# Altium schematic sheet p8_led_matrix.SchDoc
size A1; Organization: ORGANIZATION; Address1: ADDRESS 1; Address2: ADDRESS 2; Address3: ADDRESS 3; Address4: ADDRESS 4; Revision: Rev. A; SheetNumber: 8; SheetTotal: 8; ENG_APP_DATE: --/--/--; DSN_APP_DATE: --/--/--; CHK_APP_DATE: --/--/--
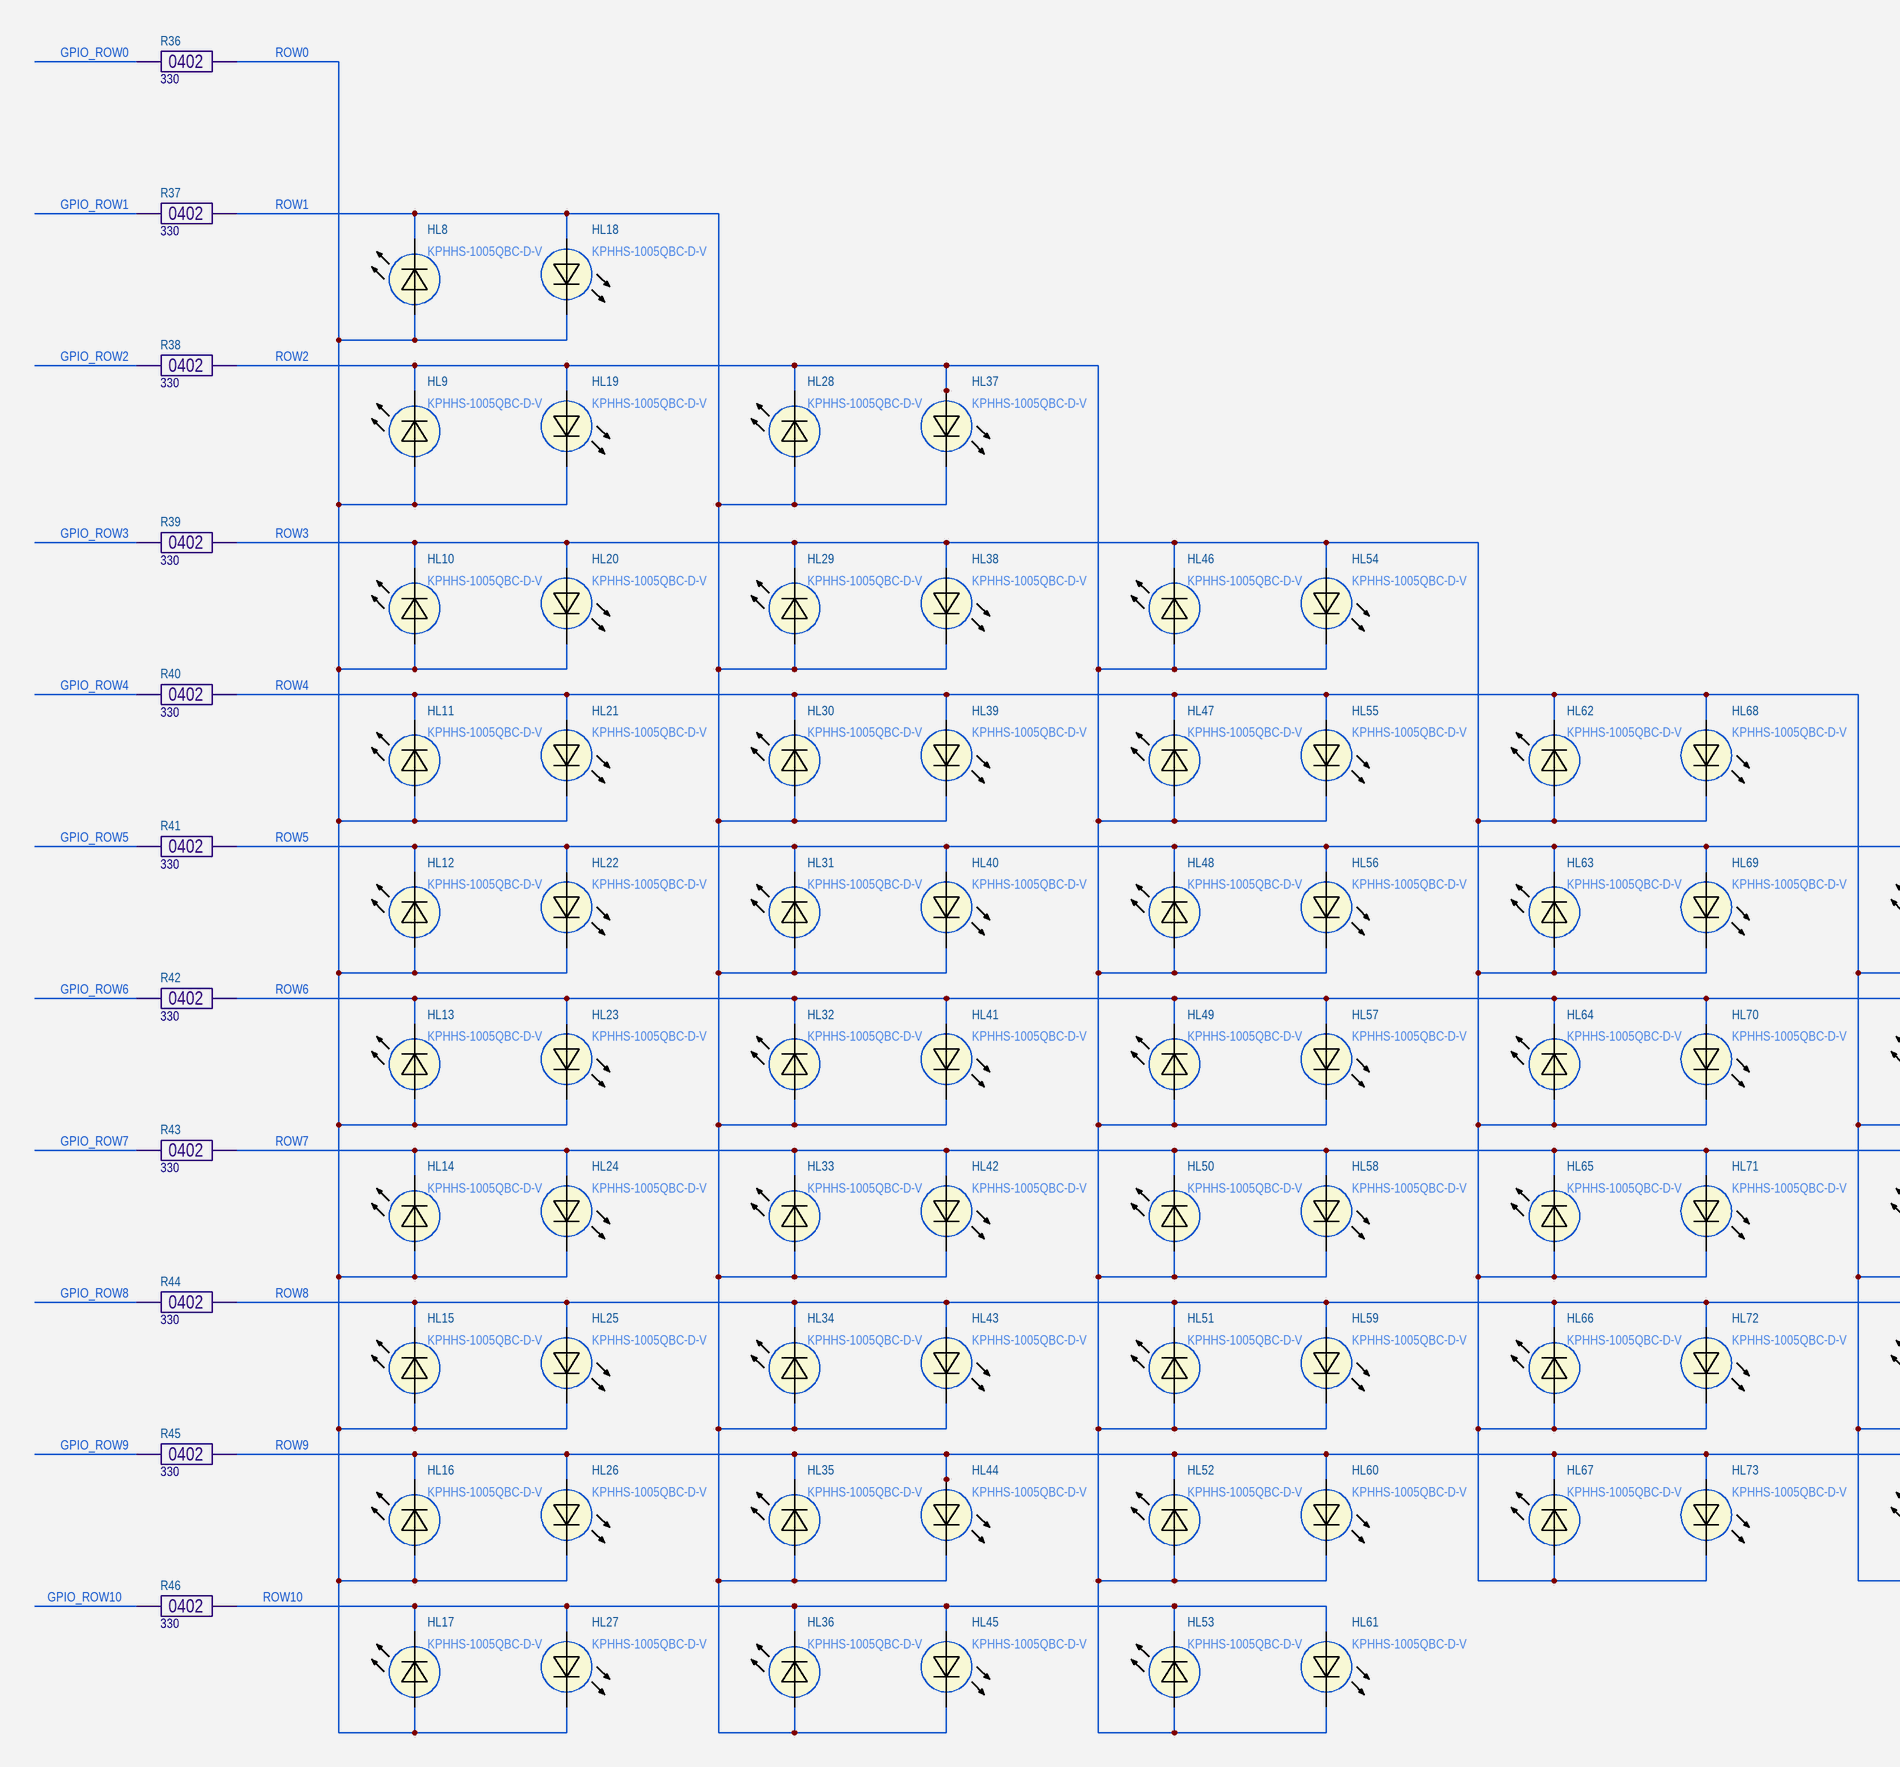
[diagram p0: p8_led_matrix.SchDoc, left]
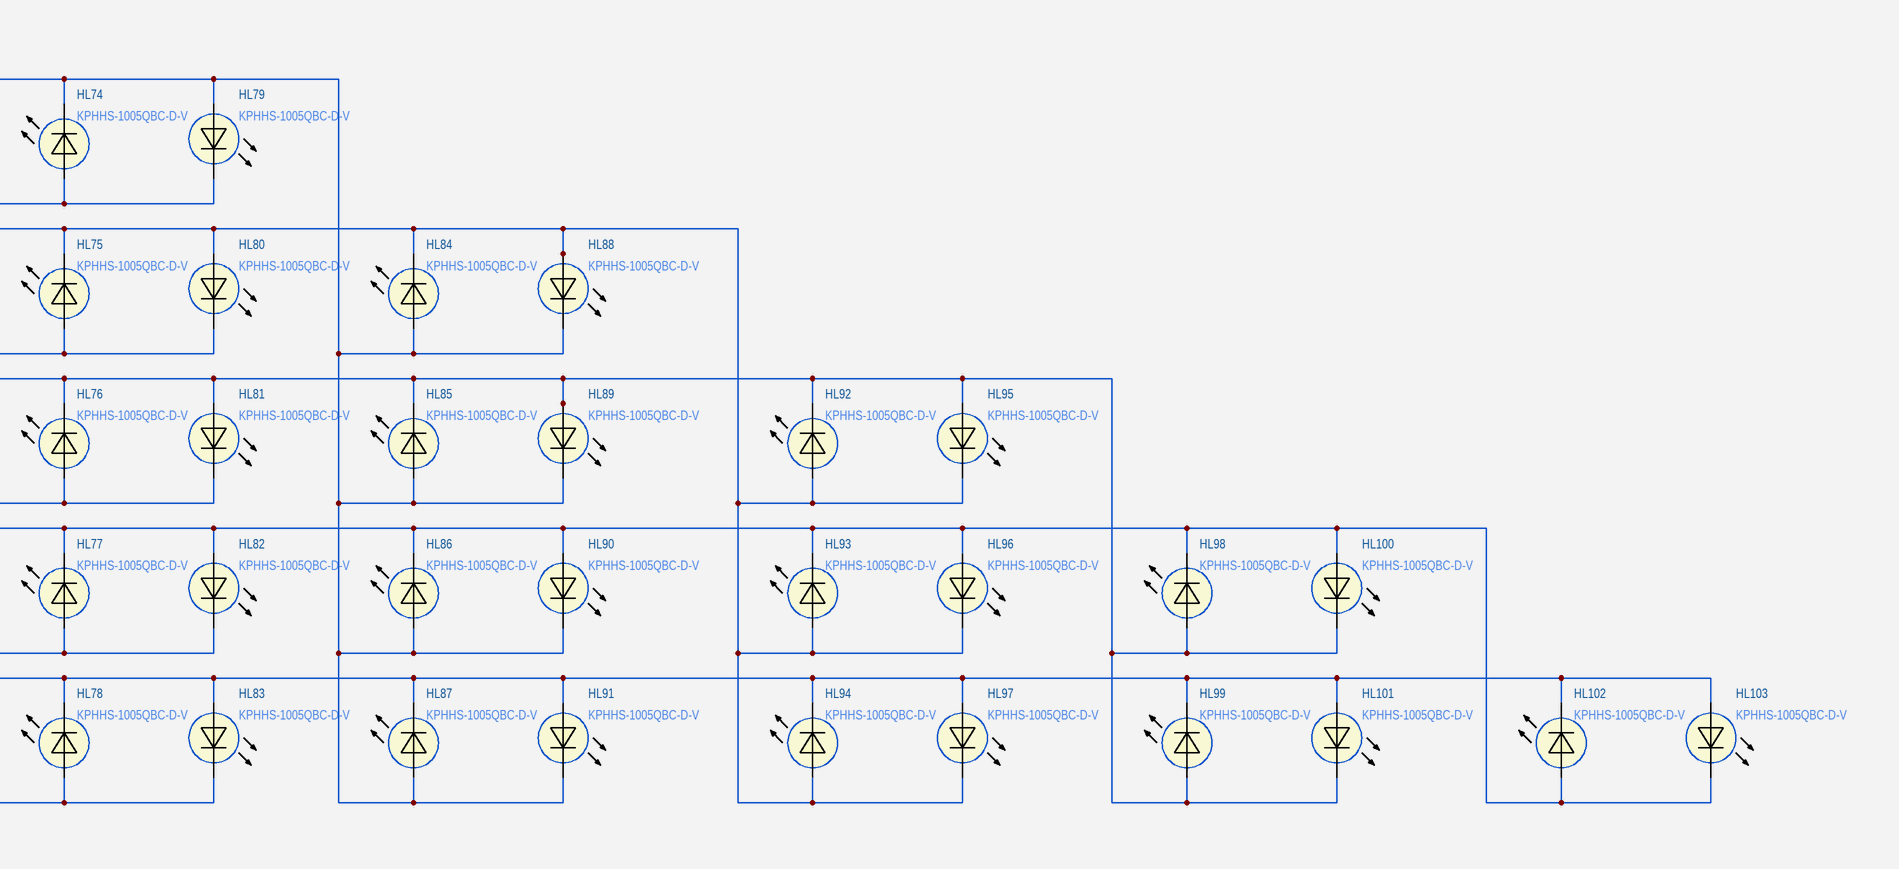
[diagram p1: p8_led_matrix.SchDoc, right]

## Parts
HL8  KPHHS-1005QBC-D-V  [LED0402B]
HL9  KPHHS-1005QBC-D-V  [LED0402B]
HL10  KPHHS-1005QBC-D-V  [LED0402B]
HL11  KPHHS-1005QBC-D-V  [LED0402B]
HL12  KPHHS-1005QBC-D-V  [LED0402B]
HL13  KPHHS-1005QBC-D-V  [LED0402B]
HL14  KPHHS-1005QBC-D-V  [LED0402B]
HL15  KPHHS-1005QBC-D-V  [LED0402B]
HL16  KPHHS-1005QBC-D-V  [LED0402B]
HL17  KPHHS-1005QBC-D-V  [LED0402B]
HL18  KPHHS-1005QBC-D-V  [LED0402B]
HL19  KPHHS-1005QBC-D-V  [LED0402B]
HL20  KPHHS-1005QBC-D-V  [LED0402B]
HL21  KPHHS-1005QBC-D-V  [LED0402B]
HL22  KPHHS-1005QBC-D-V  [LED0402B]
HL23  KPHHS-1005QBC-D-V  [LED0402B]
HL24  KPHHS-1005QBC-D-V  [LED0402B]
HL25  KPHHS-1005QBC-D-V  [LED0402B]
HL26  KPHHS-1005QBC-D-V  [LED0402B]
HL27  KPHHS-1005QBC-D-V  [LED0402B]
HL28  KPHHS-1005QBC-D-V  [LED0402B]
HL29  KPHHS-1005QBC-D-V  [LED0402B]
HL30  KPHHS-1005QBC-D-V  [LED0402B]
HL31  KPHHS-1005QBC-D-V  [LED0402B]
HL32  KPHHS-1005QBC-D-V  [LED0402B]
HL33  KPHHS-1005QBC-D-V  [LED0402B]
HL34  KPHHS-1005QBC-D-V  [LED0402B]
HL35  KPHHS-1005QBC-D-V  [LED0402B]
HL36  KPHHS-1005QBC-D-V  [LED0402B]
HL37  KPHHS-1005QBC-D-V  [LED0402B]
HL38  KPHHS-1005QBC-D-V  [LED0402B]
HL39  KPHHS-1005QBC-D-V  [LED0402B]
HL40  KPHHS-1005QBC-D-V  [LED0402B]
HL41  KPHHS-1005QBC-D-V  [LED0402B]
HL42  KPHHS-1005QBC-D-V  [LED0402B]
HL43  KPHHS-1005QBC-D-V  [LED0402B]
HL44  KPHHS-1005QBC-D-V  [LED0402B]
HL45  KPHHS-1005QBC-D-V  [LED0402B]
HL46  KPHHS-1005QBC-D-V  [LED0402B]
HL47  KPHHS-1005QBC-D-V  [LED0402B]
HL48  KPHHS-1005QBC-D-V  [LED0402B]
HL49  KPHHS-1005QBC-D-V  [LED0402B]
HL50  KPHHS-1005QBC-D-V  [LED0402B]
HL51  KPHHS-1005QBC-D-V  [LED0402B]
HL52  KPHHS-1005QBC-D-V  [LED0402B]
HL53  KPHHS-1005QBC-D-V  [LED0402B]
HL54  KPHHS-1005QBC-D-V  [LED0402B]
HL55  KPHHS-1005QBC-D-V  [LED0402B]
HL56  KPHHS-1005QBC-D-V  [LED0402B]
HL57  KPHHS-1005QBC-D-V  [LED0402B]
HL58  KPHHS-1005QBC-D-V  [LED0402B]
HL59  KPHHS-1005QBC-D-V  [LED0402B]
HL60  KPHHS-1005QBC-D-V  [LED0402B]
HL61  KPHHS-1005QBC-D-V  [LED0402B]
HL62  KPHHS-1005QBC-D-V  [LED0402B]
HL63  KPHHS-1005QBC-D-V  [LED0402B]
HL64  KPHHS-1005QBC-D-V  [LED0402B]
HL65  KPHHS-1005QBC-D-V  [LED0402B]
HL66  KPHHS-1005QBC-D-V  [LED0402B]
HL67  KPHHS-1005QBC-D-V  [LED0402B]
HL68  KPHHS-1005QBC-D-V  [LED0402B]
HL69  KPHHS-1005QBC-D-V  [LED0402B]
HL70  KPHHS-1005QBC-D-V  [LED0402B]
HL71  KPHHS-1005QBC-D-V  [LED0402B]
HL72  KPHHS-1005QBC-D-V  [LED0402B]
HL73  KPHHS-1005QBC-D-V  [LED0402B]
HL74  KPHHS-1005QBC-D-V  [LED0402B]
HL75  KPHHS-1005QBC-D-V  [LED0402B]
HL76  KPHHS-1005QBC-D-V  [LED0402B]
HL77  KPHHS-1005QBC-D-V  [LED0402B]
HL78  KPHHS-1005QBC-D-V  [LED0402B]
HL79  KPHHS-1005QBC-D-V  [LED0402B]
HL80  KPHHS-1005QBC-D-V  [LED0402B]
HL81  KPHHS-1005QBC-D-V  [LED0402B]
HL82  KPHHS-1005QBC-D-V  [LED0402B]
HL83  KPHHS-1005QBC-D-V  [LED0402B]
HL84  KPHHS-1005QBC-D-V  [LED0402B]
HL85  KPHHS-1005QBC-D-V  [LED0402B]
HL86  KPHHS-1005QBC-D-V  [LED0402B]
HL87  KPHHS-1005QBC-D-V  [LED0402B]
HL88  KPHHS-1005QBC-D-V  [LED0402B]
HL89  KPHHS-1005QBC-D-V  [LED0402B]
HL90  KPHHS-1005QBC-D-V  [LED0402B]
HL91  KPHHS-1005QBC-D-V  [LED0402B]
HL92  KPHHS-1005QBC-D-V  [LED0402B]
HL93  KPHHS-1005QBC-D-V  [LED0402B]
HL94  KPHHS-1005QBC-D-V  [LED0402B]
HL95  KPHHS-1005QBC-D-V  [LED0402B]
HL96  KPHHS-1005QBC-D-V  [LED0402B]
HL97  KPHHS-1005QBC-D-V  [LED0402B]
HL98  KPHHS-1005QBC-D-V  [LED0402B]
HL99  KPHHS-1005QBC-D-V  [LED0402B]
HL100  KPHHS-1005QBC-D-V  [LED0402B]
HL101  KPHHS-1005QBC-D-V  [LED0402B]
HL102  KPHHS-1005QBC-D-V  [LED0402B]
HL103  KPHHS-1005QBC-D-V  [LED0402B]
R36  330  Package: 0402  [RES0402B]
R37  330  Package: 0402  [RES0402B]
R38  330  Package: 0402  [RES0402B]
R39  330  Package: 0402  [RES0402B]
R40  330  Package: 0402  [RES0402B]
R41  330  Package: 0402  [RES0402B]
R42  330  Package: 0402  [RES0402B]
R43  330  Package: 0402  [RES0402B]
R44  330  Package: 0402  [RES0402B]
R45  330  Package: 0402  [RES0402B]
R46  330  Package: 0402  [RES0402B]

## Nets
GPIO_ROW0: R36.2
GPIO_ROW1: R37.2
GPIO_ROW2: R38.2
GPIO_ROW3: R39.2
GPIO_ROW4: R40.2
GPIO_ROW5: R41.2
GPIO_ROW6: R42.2
GPIO_ROW7: R43.2
GPIO_ROW8: R44.2
GPIO_ROW9: R45.2
GPIO_ROW10: R46.2
ROW0: HL8.2 HL9.2 HL10.2 HL11.2 HL12.2 HL13.2 HL14.2 HL15.2 HL16.2 HL17.2 HL18.1 HL19.1 HL20.1 HL21.1 HL22.1 HL23.1 HL24.1 HL25.1 HL26.1 HL27.1 R36.1
ROW1: HL8.1 HL18.2 HL28.2 HL29.2 HL30.2 HL31.2 HL32.2 HL33.2 HL34.2 HL35.2 HL36.2 HL37.1 HL38.1 HL39.1 HL40.1 HL41.1 HL42.1 HL43.1 HL44.1 HL45.1 R37.1
ROW2: HL9.1 HL19.2 HL28.1 HL37.2 HL46.2 HL47.2 HL48.2 HL49.2 HL50.2 HL51.2 HL52.2 HL53.2 HL54.1 HL55.1 HL56.1 HL57.1 HL58.1 HL59.1 HL60.1 HL61.1 R38.1
ROW3: HL10.1 HL20.2 HL29.1 HL38.2 HL46.1 HL54.2 HL62.2 HL63.2 HL64.2 HL65.2 HL66.2 HL67.2 HL68.1 HL69.1 HL70.1 HL71.1 HL72.1 HL73.1 R39.1
ROW4: HL11.1 HL21.2 HL30.1 HL39.2 HL47.1 HL55.2 HL62.1 HL68.2 HL74.2 HL75.2 HL76.2 HL77.2 HL78.2 HL79.1 HL80.1 HL81.1 HL82.1 HL83.1 R40.1
ROW5: HL12.1 HL22.2 HL31.1 HL40.2 HL48.1 HL56.2 HL63.1 HL69.2 HL74.1 HL79.2 HL84.2 HL85.2 HL86.2 HL87.2 HL88.1 HL89.1 HL90.1 HL91.1 R41.1
ROW6: HL13.1 HL23.2 HL32.1 HL41.2 HL49.1 HL57.2 HL64.1 HL70.2 HL75.1 HL80.2 HL84.1 HL88.2 HL92.2 HL93.2 HL94.2 HL95.1 HL96.1 HL97.1 R42.1
ROW7: HL14.1 HL24.2 HL33.1 HL42.2 HL50.1 HL58.2 HL65.1 HL71.2 HL76.1 HL81.2 HL85.1 HL89.2 HL92.1 HL95.2 HL98.2 HL99.2 HL100.1 HL101.1 R43.1
ROW8: HL15.1 HL25.2 HL34.1 HL43.2 HL51.1 HL59.2 HL66.1 HL72.2 HL77.1 HL82.2 HL86.1 HL90.2 HL93.1 HL96.2 HL98.1 HL100.2 HL102.2 HL103.1 R44.1
ROW9: HL16.1 HL26.2 HL35.1 HL44.2 HL52.1 HL60.2 HL67.1 HL73.2 HL78.1 HL83.2 HL87.1 HL91.2 HL94.1 HL97.2 HL99.1 HL101.2 HL102.1 HL103.2 R45.1
ROW10: HL17.1 HL27.2 HL36.1 HL45.2 HL53.1 HL61.2 R46.1

## Notes on the sheet
- A1
- GitHub <https://github.com/kirra-cat/druino-uno>
- view on

## Library data of the parts
HL8-HL103 = KPHHS-1005QBC-D-V: Blue led (package case 0402); Manufacturer: Kingbright Company LLC.; Designator: HL*; Forward Current: 20 mA; Forward Voltage: 3.3V; Wavelength: 465 nm; Package: 0402; Part Number: KPHHS-1005QBC-D-V; Color: Blue
R36-R46 = R0402: Resistor 0402 package case; Part Number: RC0402FR-07330RL; Manufacturer: Yageo; Tolerance: ± 1 %; Temperature Coefficient: ±100 ppm/K; Value: 330; Value on schem: 330